# Altium schematic sheet CHIBI_AMP_20181126.SchDoc: Title
size A2; PageSetup: Record=PageOptions|CenterHorizontal=True|CenterVertical=True|PrintScale=0.71|XCorrection=1.00|YCorrection=1.00|PrintKind=1|BorderSize=5000000|LeftOffset=0|BottomOffset=0|Orientation=2|PaperLength=4200|PaperWidth=2970|Scale=100|PaperSource=7|PrintQuality=600|MediaType=1|DitherType=10|PrintScaleMode=1|PaperKind=A3|PaperIndex=8; ApprovedBy: Enter Name; CheckedBy: Enter Name; DrawnBy: Enter Name; Organization: Tymphany; Address1: 2/F, BBK Building; Address2: No. 89 Ande Street, Shang Meilin; Address3: Futian District, Shenzhen; Address4: GuangDong, P.R.C. 518049, China; DocumentNumber: 5; Revision: 0.0.0; SheetNumber: 5; SheetTotal: 6; ProductName: Product Name; PartNumber: Part Number; ModifiedBy: Enter Name; LeadEngineer: Enter Name; Stage: Concept; DCR: 31m幐嶰WNERINDEX=2967; DCR: 20m幐嶰WNERINDEX=3001; DCR: 20m幐嶰WNERINDEX=3040; DCR: 31m幐嶰WNERINDEX=3085; ProjectName: Project Name
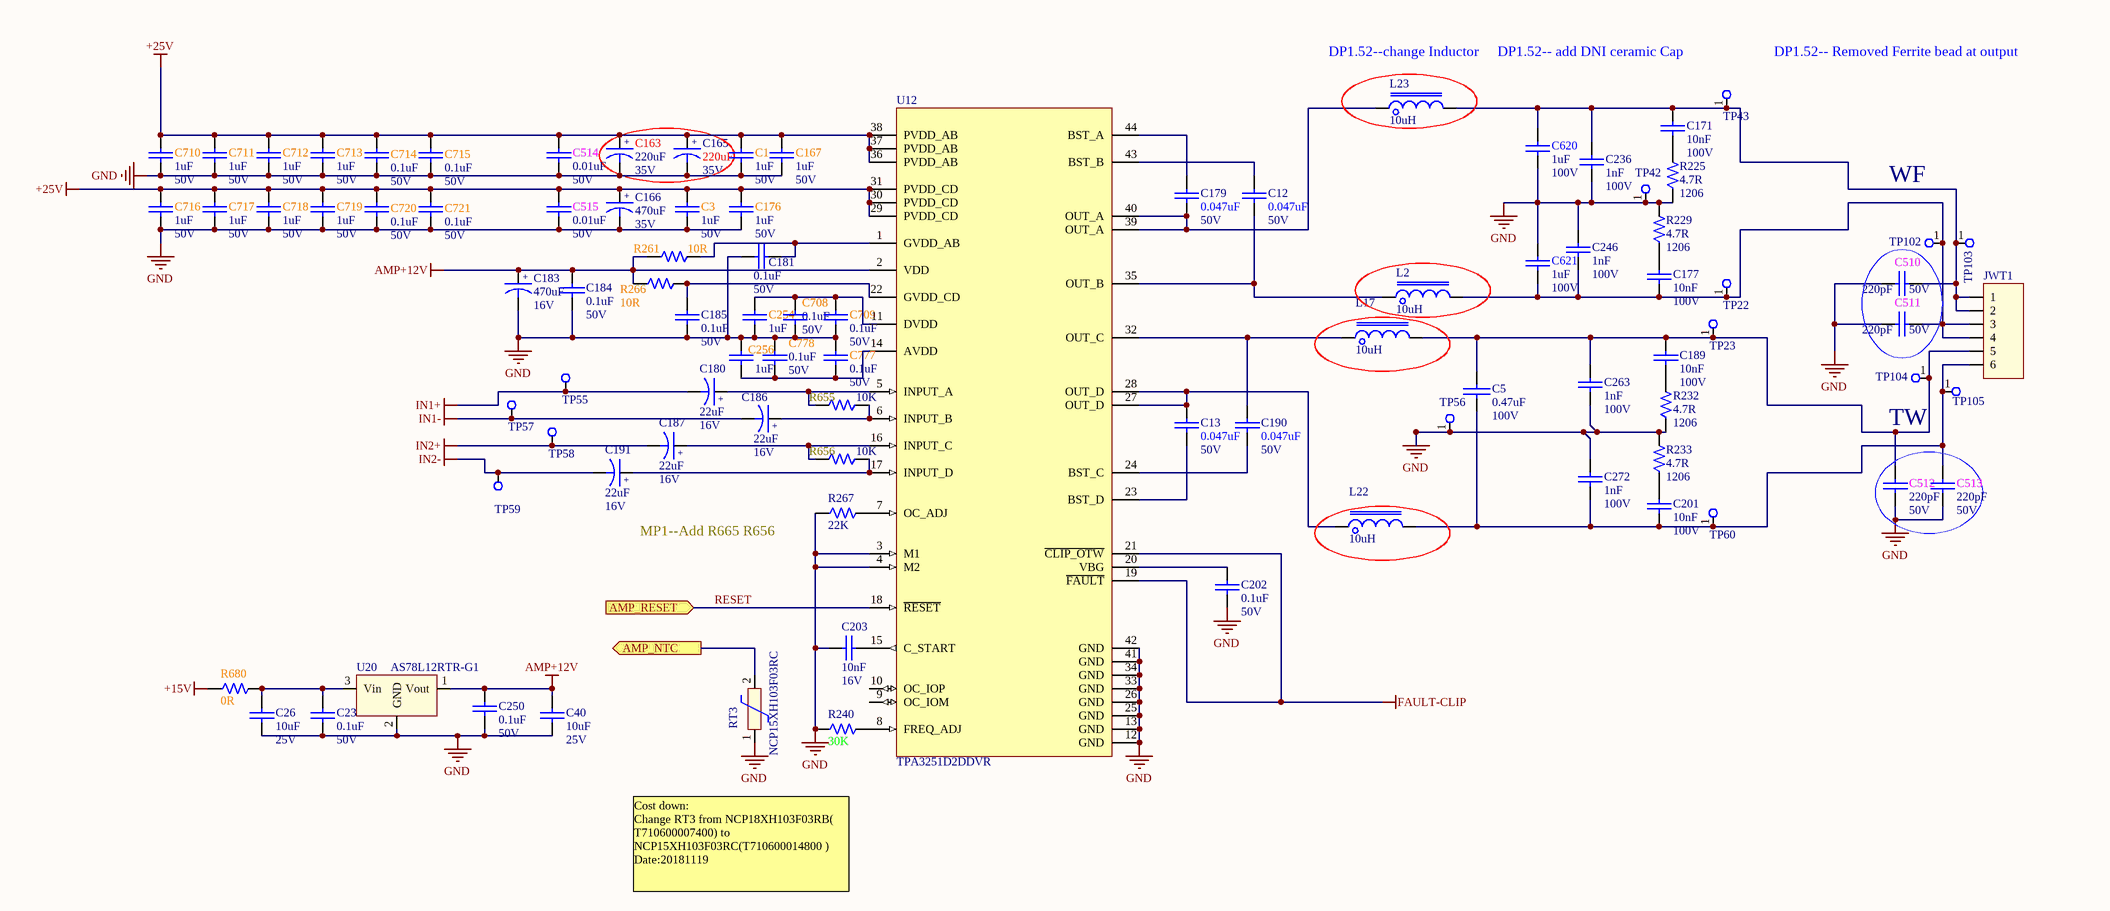
[diagram p0: CHIBI_AMP_20181126.SchDoc]

## Parts
C1  value 1uF  Voltage: 50V  [CAPC0603-RW]  (hidden comment: T542021057508)
C3  value 1uF  Voltage: 50V  [CAPC0603-RW]  (hidden comment: T542021057508)
C5  value 0.47uF  Voltage: 100V  [CAP_NP_RADIAL_T4.5W7.5H9.5P5.0]  (hidden comment: PFN2263A0-4740)
C12  value 0.047uF  Voltage: 50V  [CAPC0402-RW]  (hidden comment: PWL456470-4730)
C13  value 0.047uF  Voltage: 50V  [CAPC0402-RW]  (hidden comment: PWL456470-4730)
C23  value 0.1uF  Voltage: 50V  [CAPC0603-RW]  (hidden comment: PXL456470-1040)
C26  value 10uF  Voltage: 25V  [CAPC0805-RW]  (hidden comment: PYL426450-1060)
C40  value 10uF  Voltage: 25V  [CAPC0805-RW]  (hidden comment: PYL426450-1060)
C163  value 220uF  Voltage: 35V  [CASE - F]  (hidden comment: PBE099560-2210)
C165  value 220uF  Voltage: 35V  [CASE - F]  (hidden comment: PBE099560-2210)
C166  value 470uF  Voltage: 35V  [CASE - G12.5]  (hidden comment: T551471455000)
C167  value 1uF  Voltage: 50V  [CAPC0603-RW]  (hidden comment: T542021057508)
C171  value 10nF  Voltage: 100V  [CAPC0805-RW]  (hidden comment: PYL4564A0-1030)
C176  value 1uF  Voltage: 50V  [CAPC0603-RW]  (hidden comment: T542021057508)
C177  value 10nF  Voltage: 100V  [CAPC0805-RW]  (hidden comment: PYL4564A0-1030)
C179  value 0.047uF  Voltage: 50V  [CAPC0402-RW]  (hidden comment: PWL456470-4730)
C180  value 22uF  Voltage: 16V  [CASE - B]  (hidden comment: PBE099541-2200)
C181  value 0.1uF  Voltage: 50V  [CAPC0603-RW]  (hidden comment: PXL456470-1040)
C183  value 470uF  Voltage: 16V  [CASE - F]  (hidden comment: PBE099541-4710)
C184  value 0.1uF  Voltage: 50V  [CAPC0603-RW]  (hidden comment: PXL456470-1040)
C185  value 0.1uF  Voltage: 50V  [CAPC0603-RW]  (hidden comment: PXL456470-1040)
C186  value 22uF  Voltage: 16V  [CASE - B]  (hidden comment: PBE099541-2200)
C187  value 22uF  Voltage: 16V  [CASE - B]  (hidden comment: PBE099541-2200)
C189  value 10nF  Voltage: 100V  [CAPC0805-RW]  (hidden comment: PYL4564A0-1030)
C190  value 0.047uF  Voltage: 50V  [CAPC0402-RW]  (hidden comment: PWL456470-4730)
C191  value 22uF  Voltage: 16V  [CASE - B]  (hidden comment: PBE099541-2200)
C201  value 10nF  Voltage: 100V  [CAPC0805-RW]  (hidden comment: PYL4564A0-1030)
C202  value 0.1uF  Voltage: 50V  [CAPC0603-RW]  (hidden comment: PXL456470-1040)
C203  value 10nF  Voltage: 16V  [CAPC0402-RW]  (hidden comment: PWL456440-1030)
C236  value 1nF  Voltage: 100V  [CAPC0603-RW]  (hidden comment: PXL4564A2-1020)
C246  value 1nF  Voltage: 100V  [CAPC0603-RW]  (hidden comment: PXL4564A2-1020)
C250  value 0.1uF  Voltage: 50V  [CAPC0603-RW]  (hidden comment: PXL456470-1040)
C254  value 1uF  [CAPC0402-RW]  (hidden comment: PWL456320-1050)
C256  value 1uF  [CAPC0402-RW]  (hidden comment: PWL456440-1050)
C263  value 1nF  Voltage: 100V  [CAPC0603-RW]  (hidden comment: PXL4564A2-1020)
C272  value 1nF  Voltage: 100V  [CAPC0603-RW]  (hidden comment: PXL4564A2-1020)
C510  value 220pF  Voltage: 50V  [CAPC0402-RW]  (hidden comment: PWL410370-2210)
C511  value 220pF  Voltage: 50V  [CAPC0402-RW]  (hidden comment: PWL410370-2210)
C512  value 220pF  Voltage: 50V  [CAPC0402-RW]  (hidden comment: PWL410370-2210)
C513  value 220pF  Voltage: 50V  [CAPC0402-RW]  (hidden comment: PWL410370-2210)
C514  value 0.01uF  Voltage: 50V  [CAPC0402-RW]  (hidden comment: PWL456470-1030)
C515  value 0.01uF  Voltage: 50V  [CAPC0402-RW]  (hidden comment: PWL456470-1030)
C620  value 1uF  Voltage: 100V  [CAPC0805-RW]  (hidden comment: T54000000644C)
C621  value 1uF  Voltage: 100V  [CAPC0805-RW]  (hidden comment: T54000000644C)
C708  value 0.1uF  Voltage: 50V  [CAPC0402-RW]  (hidden comment: PWL456470-1040)
C709  value 0.1uF  Voltage: 50V  [CAPC0402-RW]  (hidden comment: PWL456470-1040)
C710  value 1uF  Voltage: 50V  [CAPC0603-RW]  (hidden comment: T542021057508)
C711  value 1uF  Voltage: 50V  [CAPC0603-RW]  (hidden comment: T542021057508)
C712  value 1uF  Voltage: 50V  [CAPC0603-RW]  (hidden comment: T542021057508)
C713  value 1uF  Voltage: 50V  [CAPC0603-RW]  (hidden comment: T542021057508)
C714  value 0.1uF  Voltage: 50V  [CAPC0402-RW]  (hidden comment: PWL456470-1040)
C715  value 0.1uF  Voltage: 50V  [CAPC0402-RW]  (hidden comment: PWL456470-1040)
C716  value 1uF  Voltage: 50V  [CAPC0603-RW]  (hidden comment: T542021057508)
C717  value 1uF  Voltage: 50V  [CAPC0603-RW]  (hidden comment: T542021057508)
C718  value 1uF  Voltage: 50V  [CAPC0603-RW]  (hidden comment: T542021057508)
C719  value 1uF  Voltage: 50V  [CAPC0603-RW]  (hidden comment: T542021057508)
C720  value 0.1uF  Voltage: 50V  [CAPC0402-RW]  (hidden comment: PWL456470-1040)
C721  value 0.1uF  Voltage: 50V  [CAPC0402-RW]  (hidden comment: PWL456470-1040)
C777  value 0.1uF  Voltage: 50V  [CAPC0402-RW]  (hidden comment: PWL456470-1040)
C778  value 0.1uF  Voltage: 50V  [CAPC0402-RW]  (hidden comment: PWL456470-1040)
JWT1  T690300097400  [CONN 6P PH=2.5MM ST]  (value not drawn)
L2  value 10uH  [IND_CKCH129]  (hidden comment: T621000054300)
L17  value 10uH  [IND_CKCH88]  (hidden comment: T621000054200)
L22  value 10uH  [IND_CKCH88]  (hidden comment: T621000054200)
L23  value 10uH  [IND_CKCH129]  (hidden comment: T621000054300)
R225  value 4.7R  PACKAGE: 1206  [1206-RW]  (hidden comment: QCF041010-4708)
R229  value 4.7R  PACKAGE: 1206  [1206-RW]  (hidden comment: QCF041010-4708)
R232  value 4.7R  PACKAGE: 1206  [1206-RW]  (hidden comment: QCF041010-4708)
R233  value 4.7R  PACKAGE: 1206  [1206-RW]  (hidden comment: QCF041010-4708)
R240  value 30K  [0402-RW]  (hidden comment: QCF161240-3002)
R261  value 10R  [0603-RW]  (hidden comment: QCF011030-1009)
R266  value 10R  [0603-RW]  (hidden comment: QCF011030-1009)
R267  value 22K  [0402-RW]  (hidden comment: QCF161240-2202)
R655  value 10K  [0402-RW]  (hidden comment: QCF161240-1002)
R656  value 10K  [0402-RW]  (hidden comment: QCF161240-1002)
R680  value 0R  [0603-RW]  (hidden comment: T502000002009)
RT3  MFG Part: NCP15XH103F03RC  [0402-RW]  (hidden comment: NTC NCP15XH103F03RC)
TP22  TP  [TP_2.0mm]  (value not drawn)
TP23  TP  [TP_2.0mm]  (value not drawn)
TP42  TP  [TP_1.8mm]  (value not drawn)
TP43  TP  [TP_2.0mm]  (value not drawn)
TP55  TP  [TP_1.2mm]  (value not drawn)
TP56  TP  [TP_1.8mm]  (value not drawn)
TP57  TP  [TP_1.2mm]  (value not drawn)
TP58  TP  [TP_1.2mm]  (value not drawn)
TP59  TP  [TP_1.2mm]  (value not drawn)
TP60  TP  [TP_2.0mm]  (value not drawn)
TP102  D1.2V  [TP_1.2mm]  (value not drawn)
TP103  D1.2V  [TP_1.2mm]  (value not drawn)
TP104  D1.2V  [TP_1.2mm]  (value not drawn)
TP105  D1.2V  [TP_1.2mm]  (value not drawn)
U12  T610500031401  [DDV(R-PDSO-G44)]  (value not drawn)
U20  T610600095367  [SOT89]  (value not drawn)

## Ports
AMP_NTC (out), AMP_RESET (in)

## Nets
+15V: R680.1
+25V: C1.1 C3.1 C163.1 C165.1 C166.1 C167.1 C176.1 C514.1 C515.1 C710.1 C711.1 C712.1 C713.1 C714.2 C715.2 C716.1 C717.1 C718.1 C719.1 C720.2 C721.2 U12.29(PVDD_CD) U12.30(PVDD_CD) U12.31(PVDD_CD) U12.36(PVDD_AB) U12.37(PVDD_AB) U12.38(PVDD_AB)
AMP+12V: C40.1 C183.1 C184.1 C250.2 R261.1 R266.1 U12.2(VDD) U20.1(Vout)
FAULT-CLIP: U12.19(~{FAULT}) U12.21(~{CLIP_OTW})
GND: C1.2 C3.2 C23.2 C26.2 C40.2 C163.2 C165.2 C166.2 C167.2 C176.2 C181.1 C183.2 C184.2 C185.1 C202.2 C203.1 C236.2 C246.1 C250.1 C254.1 C256.1 C263.2 C272.1 C510.2 C511.2 C512.2 C513.2 C514.2 C515.2 C620.2 C621.1 C708.2 C709.2 C710.2 C711.2 C712.2 C713.2 C714.1 C715.1 C716.2 C717.2 C718.2 C719.2 C720.1 C721.1 C777.1 C778.1 R225.1 R229.2 R232.1 R233.2 R240.1 R267.1 RT3.1 TP42.1 TP56.1 U12.3(M1) U12.4(M2) U12.12(GND) U12.13(GND) U12.25(GND) U12.26(GND) U12.33(GND) U12.34(GND) U12.41(GND) U12.42(GND) U20.2(GND)
IN1+: C180.2 TP55.1
IN1-: C186.2 TP57.1
IN2+: C187.2 TP58.1
IN2-: C191.2 TP59.1
AMP_NTC: RT3.2 ; port AMP_NTC
RESET: U12.18(~{RESET}) ; port AMP_RESET
NetC5_1: C5.1 C189.1 C263.1 C512.1 JWT1.5 L17.2 TP23.1 TP104.1
NetC5_2: C5.2 C201.2 C272.2 C513.1 JWT1.6 L22.2 TP60.1 TP105.1
NetC12_1: C12.1 U12.43(BST_B)
NetC12_2: C12.2 L2.1 U12.35(OUT_B)
NetC13_1: C13.1 L22.1 U12.27(OUT_D) U12.28(OUT_D)
NetC13_2: C13.2 U12.23(BST_D)
NetC23_1: C23.1 C26.1 R680.2 U20.3(Vin)
NetC171_1: C171.1 C236.1 C510.1 C620.1 JWT1.1 JWT1.2 L23.2 TP43.1 TP103.1
NetC171_2: C171.2 R225.2
NetC177_1: C177.1 R229.1
NetC177_2: C177.2 C246.2 C511.1 C621.2 JWT1.3 JWT1.4 L2.2 TP22.1 TP102.1
NetC179_1: C179.1 U12.44(BST_A)
NetC179_2: C179.2 L23.1 U12.39(OUT_A) U12.40(OUT_A)
NetC180_1: C180.1 R655.2 U12.5(INPUT_A)
NetC181_2: C181.2 R261.2 U12.1(GVDD_AB)
NetC185_2: C185.2 R266.2 U12.22(GVDD_CD)
NetC186_1: C186.1 R655.1 U12.6(INPUT_B)
NetC187_1: C187.1 R656.2 U12.16(INPUT_C)
NetC189_2: C189.2 R232.2
NetC190_1: C190.1 L17.1 U12.32(OUT_C)
NetC190_2: C190.2 U12.24(BST_C)
NetC191_1: C191.1 R656.1 U12.17(INPUT_D)
NetC201_1: C201.1 R233.1
NetC202_1: C202.1 U12.20(VBG)
NetC203_2: C203.2 U12.15(C_START)
NetC254_2: C254.2 C708.1 C709.1 U12.11(DVDD)
NetC256_2: C256.2 C777.2 C778.2 U12.14(AVDD)
NetR240_2: R240.2 U12.8(FREQ_ADJ)
NetR267_2: R267.2 U12.7(OC_ADJ)

Not connected (* = marked no-connect by the designer): U12 9(OC_IOM) 10(OC_IOP)

## Notes on the sheet
- (near L23) DP1.52--change Inductor
- DP1.52-- add DNI ceramic Cap
- DP1.52-- Removed Ferrite bead at output
- WF
- (near TP104) TW
- MP1--Add R665 R656
- Cost down:
  Change RT3 from NCP18XH103F03RB( T710600007400) to NCP15XH103F03RC(T710600014800 )
  Date:20181119
- Version
- Date
- Description of Changes/Notes
- Client
- (Hui Zhou) Co. Ltd., Shenzhen Branch
- Premium Loudspeakers
- Product:
- File Name:
- Page Title:
- CHIBI
- CHIBI Main Board
- Requirement of Tymphany Parts:
  1. Comply with Tymphany QSI057-1031 "Green Product Chemical Substances Specification".
  2. Follow customer's specification as required.
  3. Follow Halogen Free requirement: Br<900 ppm, Cl<900 ppm, Br+Cl< 1500 ppm if required.
- www.Tymphany.com
- Tel: + 86 755-339-121-88
- GuangDong, P.R.C. 518049, China
- Futian District, Shenzhen
- No. 89 Ande Street, Shang Meilin
- 2/F, BBK Building
- Revision:
- Stage:
- Lead Engineer:
- Date:
- Part Number:
- SOP(Ver B)
- 3.1.1
- Sam
- T651000009390
- Drawn By:
- Checked By:
- Time:
- Gavin
- Mod By:
- Approved By:
- Sheet:
- Mod Date:
- Size:
- A2
- of
- Seb
- (in symbol CAP E 22uF 16V 20% SMD_CASE-B) +
- (in symbol CAP E 220uF 35V 20% SMD) +
- (in symbol CAP E 470u 16V 20% SMD) +
- (in symbol CAP E 470uF 35V 20% SMD_VZH471M1V1013-TR0) +

## Library data of the parts
C1 C3 C167 C176 C710-C713 C716-C719 = CAP0603 1uF 50V 10%_X7R_WALSIN: CAP X7R 1.0UF 50V +-10% 0603 WALSIN L; Tolerance: 10%; Type: Capacitor; CREATE_NAME: Nathan; SAP: T542021057508; PACKAGE: CAPC0603; Vendor Name: *; MFG: WALSIN; MFG Part: *; Other: X7R; CREATE_TIME: 13-July-2016
C5 = CAP E METAL 0.47uF 100V 5%: COND METAL 0.47uF 100V 5% MINIBOX; SAP: T560000000530; Vendor Name: 惠州市佳维诚电子有限公司; Vendor Code: 10020154; MFG: 佳维诚; Type: Capacitor; PACKAGE: 0.47uF/100V; MFG Part: *; Other: *; Tolerance: 5%
C12 C13 C179 C190 = CAP0402 0.047uF 50V 10%: CAP, CER, 0.047uF, 10%, 50V, X7R, 0402, RoHS; SAP: T542014737508; Type: Capacitor; CREATE_NAME: TOM@Deftronics; PACKAGE: CAPC0402; Vendor Name: *; MFG: *; MFG Part: *; Other: X7R; Tolerance: 10%; CREATE_TIME: 13-May-2014
C23 = CAP0603 0.1uF 50V 10% - PXL456470-1040: GP CHIP CAP 0.1uF 50V 10% 0603 TYPE X7R; SAP: T542021047508; Vendor Code: 10010262; Vendor Name: 东莞市晴远电子有限公司; Type: Capacitor; PACKAGE: CAPC0603; MFG: *; MFG Part: *; Other: X7R; Tolerance: 10%
C26 C40 = CAP0805 10uF 25V 10%: CAP, CER, 10uF, 10%, 25V, X5R, 0805, RoHS; SAP: T545031067408; Type: Capacitor; CREATE_NAME: TOM@Deftronics; PACKAGE: CAP0805; Vendor Code: *; Vendor Name: *; MFG: *; MFG Part: *; Other: X5R; Tolerance: 10%; CREATE_TIME: 13-May-2014
C163 C165 = CAP E 220uF 35V 20% SMD: CHIP ELECT 20% 35V SMD D8xL10.2mm 220uF; SAP: T551221452010; Type: Capacitor; PACKAGE: CASE - D; Vendor Name: *; Vendor Code: *; MFG: *; MFG Part: *; Other: *; Tolerance: 20%
C166 = CAP E 470uF 35V 20% SMD_VZH471M1V1013-TR0: E 470UF 35V +-20% 10*12. VZH471M1V K; MFG: LELON; Tolerance: 20%; Type: Capacitor; CREAT NAME: Nathan; SAP: T551471455000; PACKAGE: 470uF/35V; Vendor Name: *; Vendor Code: *; MFG Part: VZH471M1V1013-TR0; Other: *; CREAT TIME: 08-July-2016
C171 C177 C189 C201 = CAP0805 10nF 100V 10%: CHIP CAP 10nF 100V 10% 0805 TYPE X7R; SAP: T542031037608; MFG: Walsin; Type: Capacitor; PACKAGE: CAPC0805; Vendor Code: *; Vendor Name: *; MFG Part: *; Other: X7R; Tolerance: 10%
C180 C186 C187 C191 = CAP E 22uF 16V 20% SMD_CASE-B: E 22UF 16V +-20% 4X5.4M CK1C220M-CRC54 G; SAP: T551220434010; MFG: NORMAL; Tolerance: 20%; Type: Capacitor; PACKAGE: CASE - B; Vendor Name: *; Vendor Code: *; MFG Part: CK1C220M-CRC54; Other: *
C181 C184 C185 C202 C250 = CAP0603 0.1uF 50V 10% - PXL456470-1040: GP CHIP CAP 0.1uF 50V 10% 0603 TYPE X7R; SAP: T542021047508; Vendor Code: 10010262; Vendor Name: ???????????; Type: Capacitor; PACKAGE: CAPC0603; MFG: *; MFG Part: *; Other: X7R; Tolerance: 10%
C183 = CAP E 470u 16V 20% SMD: CHIP ELECT 20% 16V 150' SMD 470uF 8*10.5mm; SAP: T551471434010; MFG: SEMTECH; CREATE_NAME: GordonL@Deftronics; Type: Capacitor; PACKAGE: CASE - F; Vendor Name: *; Vendor Code: *; MFG Part: *; Other: *; Tolerance: 20%; CREATE_TIME: 26-SEP-2012
C203 = CAP0402 10nF 16V 10%: CHIP CAP 10% 16V 0402 X7R Walsin 10nF; SAP: T542011037308; Type: Capacitor; PACKAGE: CAPC0402; Vendor Code: *; Vendor Name: Walsin; MFG: *; MFG Part: *; Other: X7R; Tolerance: 10%
C236 C246 C263 C272 = CAP0603 1nF 100V 10% - PXL4564A2-1020: CHIP CAP 1nF 100V 10%; SAP: T542021027608; Vendor Code: 10010262; Vendor Name: 东莞市晴远电子有限公司; Type: Capacitor; PACKAGE: CAPC0603; MFG: *; MFG Part: *; Other: *; Tolerance: 10%
C254 = CAP0402 1uF 6.3V 5%: CAP, CER, 1uF, 5%, 6.3V, X7R, 0402, RoHS; SAP: T542011057108; Type: Capacitor; CREATE_NAME: TOM@Deftronics; PACKAGE: CAPC0402; Vendor Name: *; MFG: *; MFG Part: *; Other: X7R; Tolerance: 5%; CREATE_TIME: 13-May-2014; Voltage: 6.3V
C256 = CAP0402 1uF 16V 10%: CHIP CAP 10% 16V 0402 X7R 1uF; SAP: T542011057308; Vendor Name: 华新科技股份有限公司; MFG: Walsin; Type: Capacitor; PACKAGE: CAPC0402; MFG Part: *; Other: X7R; Tolerance: 10%; Voltage: 16V
C510-C513 = CAP0402 220pF 50V 5%: CHIP CAP 220pF 50V 5% 0402 TYPE NPO; SAP: T541012216508; Vendor Name: 华新科技股份有限公司; MFG: Walsin; Type: Capacitor; PACKAGE: CAPC0402; MFG Part: *; Other: NPO; Tolerance: 5%
C514 C515 = CAP0402 0.01uF 50V 10%: CAP, CER, 0.01uF, 10%, 50V, X7R, 0402, RoHS; SAP: T542011037508; Type: Capacitor; CREATE_NAME: Evan@Deftronics; PACKAGE: CAPC0402; Vendor Name: *; MFG: *; MFG Part: *; Other: X7R; Tolerance: 10%; CREATE_TIME: 26-May-2014
C620 C621 = CAPC0805 1uF 100V 10%_X7S_TDK: CAP 1.0UF 100V +-10% 0805X7S TDK L; Other: X7S; Tolerance: 10%; Type: Capacitor; CREATE_NAME: Nathan; SAP: T54000000644C; PACKAGE: CAP0805; Vendor Code: *; Vendor Name: *; MFG: TDK; MFG Part: *; CREATE_TIME: 06-Aug-2016
C708 C709 C714 C715 C720 C721 C777 C778 = CAP0402 0.1uF 50V 10%: CAP, CER, 0.1uF, 10%, 50V, X7R, 0402, RoHS; SAP: T542011047508; Type: Capacitor; CREATE_NAME: TOM@Deftronics; PACKAGE: CAPC0402; Vendor Name: *; MFG: *; MFG Part: *; Other: X7R; Tolerance: 10%; CREATE_TIME: 13-May-2014
JWT1 = CONN 6P PH=2.5MM ST: CONNECTOR TJC3-6A-CS 6 PIN G; Value: 2.5mm; MFG: 金佳电子; CREATE_NAME: Tom; SAP: T690300097400; MFG Part: TJC3-6A-CS; Vendor Name: *; Vendor Code: *; Type: Connector; Current: *; CREATE_TIME: 27-Dec-2016
L2 L23 = IND 10uH CKCH129-10UH\M: 10UH 10A 100K 12.3 CENKER CKCH129 K; Type: INDUCTOR; CREATE_NAME: Nathan; SAP: T621000054300; MFG: CENKER; Vendor Code: *; Vendor Name: *; Voltage: *; CREATE_TIME: 27-Dec-2017; Idc: 10A; MFG Part: CKCH129-10UH\M
L17 L22 = IND 10uH CKCH88-10UH\M: 10UH 6A 100K 8.0X CENKER CKCH88- K; Type: INDUCTOR; CREATE_NAME: Nathan; SAP: T621000054200; MFG: CENKER; Vendor Code: *; Vendor Name: *; Voltage: *; CREATE_TIME: 27-Dec-2017; Isat: 6A; MFG Part: CKCH88-10UH\M
R225 R229 R232 R233 = RES1206 1/4W 1% 4.7 OHM: CHIP RES 4.7 OHM 1/4 W 1% 1206; Vendor Code: 10010262; SAP: T502470B04399; Vendor Name: 东莞市晴远电子有限公司; Power: *; MFG Part: *; MFG: *; TOL: 1%; Type: Resistor
R240 = RES0402 1/16W 1% 30K OHM: CHIP RES  30K OHM 1/16W 1% 0402; SAP: T502300201399; CREATE_NAME: GordonL@Deftronics; Vendor Code: *; Power: *; Vendor Name: *; MFG Part: *; MFG: *; TOL: 1%; Type: Resistor; CREATE_TIME: 24-Feb-2014; PACKAGE: 0402
R261 R266 = RES0603 1/10W 1% 10 OHM: GP CHIP RES. 10 OHM 1/10W 1% 0603; Vendor Code: 10010262; SAP: T502100A02399; Vendor Name: 东莞市晴远电子有限公司; Power: *; MFG Part: *; MFG: *; TOL: 1%; Type: Resistor; PACKAGE: 0603
R267 = RES0402 1/16W 1% 22K OHM: CHIP RES 22K OHM 1/16W 1% 0402; SAP: T502220201399; MFG: WALSIN; Vendor Code: *; Power: *; Vendor Name: *; MFG Part: *; TOL: 1%; Type: Resistor; PACKAGE: 0402
R655 R656 = RES0402 1/16W 1% 10K OHM: CHIP RES 10K OHM 1/16W 1% 0402; SAP: T502100201399; MFG: WALSIN; Vendor Code: *; Power: *; Vendor Name: *; MFG Part: *; TOL: 1%; Type: Resistor; PACKAGE: 0402
R680 = RES0603 1/10W 0 OHM_WALSIN: CHIP 0 OHM 0 OHM 0 OHM 0603 WALSIN L; MFG Part: WR06X000PTL; MFG: WALSIN (華新); Vendor Code: *; SAP: T502000002009; Power: *; Vendor Name: *; TOL: *; Type: Resistor; PACKAGE: 0603
RT3 = NTC NCP15XH103F03RC: NTC Thermistor NCP15XH103F03RC; MFG: muRata; CREATE_NAME: Nathan; DIP&SMD: SMD; Vendor Code: *; Vendor Name: *; SAP: *; Value: *; Package: *; CREATE_TIME: 25-Aug-2016; Tolerance: *; Power: *; Current: *; Type: NTC; Customer Specific: N/A
TP102-TP105 = TP
U12 = TPA3251D2DDVR: OP TPA3251D2DDVR HTSSOP-4 TI G; CREATE_NAME: Tom; MFG: TI; Vendor Code: *; Vendor Name: *; SAP: T610500031401; Type: IC; CREATE_TIME: 12-Sep-2016; MFG Part: TPA3251D2DDVR
U20 = AS78L12RTR-G1: REG AS78L12RTR-G1 SOT-89 DIODES G; MFG: DIODES INCORPORATED (BCD); CREAT_NAME: Nathan; SAP: T610600095367; Vendor Code: *; Vendor Name: *; Type: IC; CREAT_TIME: 17-AUG-2016; MFG Part: AS78L12RTR-G1